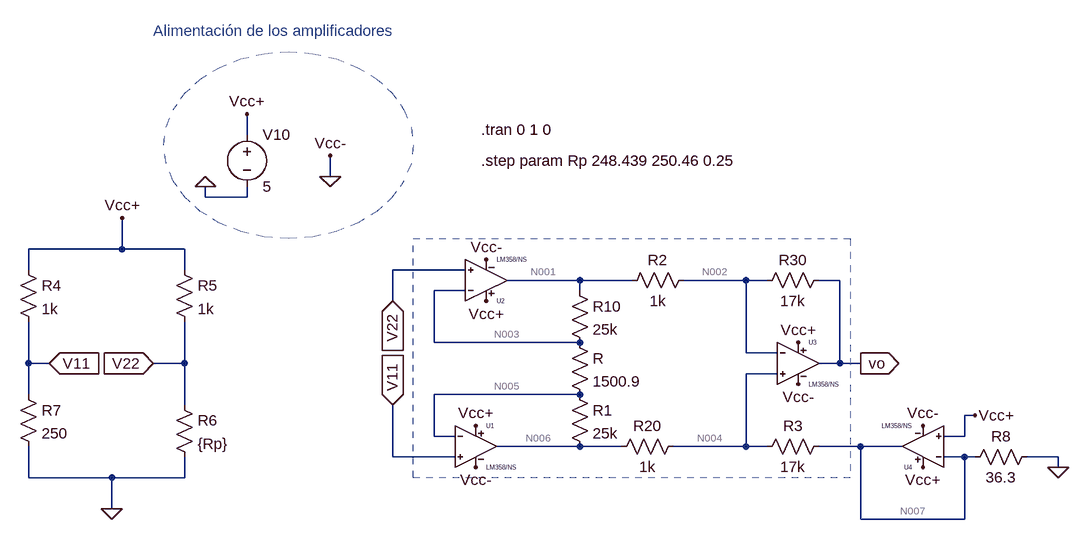
[diagram p0: schematic Ampli+puente.asc]
Ampli+puente.asc, the LTspice schematic file:
Version 4
SHEET 1 1256 680
WIRE -240 -256 -240 -288
WIRE -112 -192 -112 -224
WIRE -304 -160 -304 -176
WIRE -240 -160 -240 -176
WIRE -240 -160 -304 -160
WIRE -432 -80 -432 -128
WIRE -432 -80 -576 -80
WIRE -336 -80 -432 -80
WIRE -576 -48 -576 -80
WIRE -336 -48 -336 -80
WIRE 96 -48 -16 -48
WIRE 272 -32 160 -32
WIRE 352 -32 272 -32
WIRE 528 -32 432 -32
WIRE 560 -32 528 -32
WIRE 672 -32 640 -32
WIRE 96 -16 48 -16
WIRE 272 -16 272 -32
WIRE -16 0 -16 -48
WIRE 48 64 48 -16
WIRE 272 64 48 64
WIRE 528 80 528 -32
WIRE 576 80 528 80
WIRE -576 96 -576 32
WIRE -544 96 -576 96
WIRE -336 96 -336 32
WIRE -336 96 -384 96
WIRE 672 96 672 -32
WIRE 672 96 640 96
WIRE 704 96 672 96
WIRE 576 112 528 112
WIRE -576 144 -576 96
WIRE 272 144 48 144
WIRE -336 160 -336 96
WIRE 880 176 864 176
WIRE 48 208 48 144
WIRE 80 208 48 208
WIRE 864 208 864 176
WIRE 864 208 832 208
WIRE 272 224 144 224
WIRE 336 224 272 224
WIRE 528 224 528 112
WIRE 528 224 416 224
WIRE 560 224 528 224
WIRE 704 224 640 224
WIRE 768 224 704 224
WIRE -16 240 -16 160
WIRE 80 240 -16 240
WIRE 864 240 832 240
WIRE 880 240 864 240
WIRE 1008 240 960 240
WIRE 1008 256 1008 240
WIRE -576 272 -576 224
WIRE -448 272 -576 272
WIRE -336 272 -336 240
WIRE -336 272 -448 272
WIRE -448 320 -448 272
WIRE 704 336 704 224
WIRE 864 336 864 240
WIRE 864 336 704 336
FLAG 704 96 vo
IOPIN 704 96 Out
FLAG -240 -288 Vcc+
FLAG 112 256 Vcc-
FLAG 128 0 Vcc+
FLAG 128 -64 Vcc-
FLAG 112 192 Vcc+
FLAG 608 64 Vcc+
FLAG 608 128 Vcc-
FLAG -112 -224 Vcc-
FLAG -304 -176 0
FLAG -112 -192 0
FLAG -16 0 V22
IOPIN -16 0 In
FLAG -384 96 V22
IOPIN -384 96 In
FLAG -544 96 V11
IOPIN -544 96 In
FLAG -16 160 V11
IOPIN -16 160 In
FLAG 800 256 Vcc+
FLAG 800 192 Vcc-
FLAG 880 176 Vcc+
FLAG 1008 256 0
FLAG -448 320 0
FLAG -432 -128 Vcc+
SYMBOL LM358 112 160 R0
SYMATTR InstName U1
SYMBOL LM358 128 32 M180
SYMATTR InstName U2
SYMBOL LM358 608 32 R0
SYMATTR InstName U3
SYMBOL res 256 -32 R0
SYMATTR InstName R10
SYMATTR Value 25k
SYMBOL res 256 48 R0
SYMATTR InstName R
SYMATTR Value 1500.9
SYMBOL res 256 128 R0
SYMATTR InstName R1
SYMATTR Value 25k
SYMBOL res 448 -48 R90
WINDOW 0 0 56 VBottom 2
WINDOW 3 32 56 VTop 2
SYMATTR InstName R2
SYMATTR Value 1k
SYMBOL res 432 208 R90
WINDOW 0 0 56 VBottom 2
WINDOW 3 32 56 VTop 2
SYMATTR InstName R20
SYMATTR Value 1k
SYMBOL res 656 -48 R90
WINDOW 0 0 56 VBottom 2
WINDOW 3 32 56 VTop 2
SYMATTR InstName R30
SYMATTR Value 17k
SYMBOL voltage -240 -272 R0
WINDOW 123 0 0 Left 0
WINDOW 39 0 0 Left 0
SYMATTR InstName V10
SYMATTR Value 5
SYMBOL res 656 208 R90
WINDOW 0 0 56 VBottom 2
WINDOW 3 32 56 VTop 2
SYMATTR InstName R3
SYMATTR Value 17k
SYMBOL res -592 -64 R0
SYMATTR InstName R4
SYMATTR Value 1k
SYMBOL res -352 -64 R0
SYMATTR InstName R5
SYMATTR Value 1k
SYMBOL res -352 144 R0
SYMATTR InstName R6
SYMATTR Value {Rp}
SYMBOL res -592 128 R0
SYMATTR InstName R7
SYMATTR Value 250
SYMBOL LM358 800 288 R180
SYMATTR InstName U4
SYMBOL res 976 224 R90
WINDOW 0 0 56 VBottom 2
WINDOW 3 32 56 VTop 2
SYMATTR InstName R8
SYMATTR Value 36.3
TEXT 120 -264 Left 2 !.tran 0 1 0
TEXT -384 -416 Left 2 ;Alimentación de los amplificadores
TEXT 120 -216 Left 2 !.step param Rp 248.439 250.46 0.25
RECTANGLE Normal 688 272 16 -96 2
CIRCLE Normal 16 -96 -368 -384 2

The netlist it stands for:
* Ampli+puente.asc
XU1 V11 N005 Vcc+ 0 N006 LM358/NS LM358/NS LM358/NS  ; pins In+ In- V+ V- OUT
XU2 V22 N003 Vcc+ 0 N001 LM358/NS LM358/NS LM358/NS  ; pins In+ In- V+ V- OUT
XU3 N004 N002 Vcc+ 0 vo LM358/NS LM358/NS LM358/NS  ; pins In+ In- V+ V- OUT
R10 N001 N003 25k
R N003 N005 1500.9
R1 N005 N006 25k
R2 N002 N001 1k
R20 N004 N006 1k
R30 vo N002 17k
V10 Vcc+ 0 5
R3 N007 N004 17k
R4 Vcc+ V11 1k
R5 Vcc+ V22 1k
R6 V22 0 {Rp}
R7 V11 0 250
XU4 Vcc+ N007 Vcc+ 0 N007 LM358/NS LM358/NS LM358/NS  ; pins In+ In- V+ V- OUT
R8 0 N007 36.3
.tran 0 1 0
* Alimentación de los amplificadores
.step param Rp 248.439 250.46 0.25
.lib lm358.mod
.backanno
.end

* Results of the author's LTspice run, read from the files saved beside the schematic
* Operating Point (first step), zero values left out:
*   rp = 248.4 
*   V(n005) = 1.002 V
*   V(v11) = 1 V
*   V(vcc+) = 5 V
*   V(n006) = 1.084 V
*   V(n003) = 996.9 mV
*   V(v22) = 995 mV
*   V(n001) = 912.7 mV
*   V(n002) = 1.081 V
*   V(n004) = 1.098 V
*   V(vo) = 3.941 V
*   V(n007) = 1.336 V
*   I(R8) = -36.8 mA
*   I(R7) = 4 mA
*   I(R6) = 4.005 mA
*   I(R5) = 4.005 mA
*   I(R4) = 4 mA
*   I(R3) = 13.98 µA
*   I(R30) = 168.2 µA
*   I(R20) = 14 µA
*   I(R2) = 168.3 µA
*   I(R1) = -3.293 µA
*   I(R) = -3.331 µA
*   I(R10) = -3.369 µA
*   I(V10) = -44.7 mA
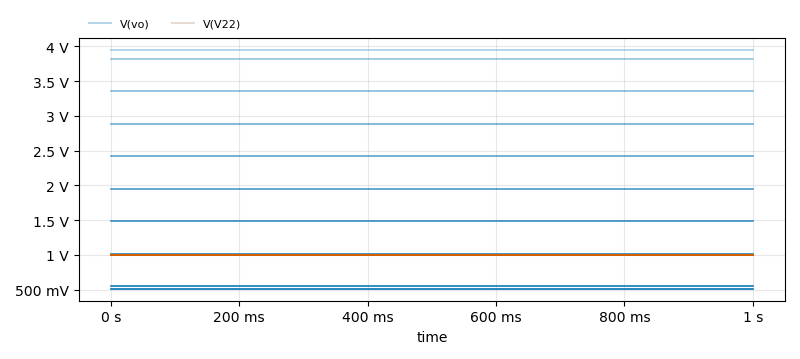
[diagram p1: Transient Analysis of Ampli+puente.asc, plotted from the saved traces]
* Transient Analysis, 10 runs:
*   V(vo) [rp=248.439]: min 3.941 V, max 3.941 V, average 3.941 V, rms 3.941 V, last 3.941 V
*   V(vo) [rp=248.689]: min 3.816 V, max 3.816 V, average 3.816 V, rms 3.816 V, last 3.816 V
*   V(vo) [rp=248.939]: min 3.352 V, max 3.352 V, average 3.352 V, rms 3.352 V, last 3.352 V
*   V(vo) [rp=249.189]: min 2.885 V, max 2.885 V, average 2.885 V, rms 2.885 V, last 2.885 V
*   V(vo) [rp=249.439]: min 2.418 V, max 2.418 V, average 2.418 V, rms 2.418 V, last 2.418 V
*   V(vo) [rp=249.689]: min 1.951 V, max 1.951 V, average 1.951 V, rms 1.951 V, last 1.951 V
*   V(vo) [rp=249.939]: min 1.485 V, max 1.485 V, average 1.485 V, rms 1.485 V, last 1.485 V
*   V(vo) [rp=250.189]: min 1.018 V, max 1.018 V, average 1.018 V, rms 1.018 V, last 1.018 V
*   V(V22) [rp=248.439]: min 995 mV, max 995 mV, average 995 mV, rms 995 mV, last 995 mV
*   V(V22) [rp=248.689]: min 995.8 mV, max 995.8 mV, average 995.8 mV, rms 995.8 mV, last 995.8 mV
*   V(V22) [rp=248.939]: min 996.6 mV, max 996.6 mV, average 996.6 mV, rms 996.6 mV, last 996.6 mV
*   V(V22) [rp=249.189]: min 997.4 mV, max 997.4 mV, average 997.4 mV, rms 997.4 mV, last 997.4 mV
*   V(V22) [rp=249.439]: min 998.2 mV, max 998.2 mV, average 998.2 mV, rms 998.2 mV, last 998.2 mV
*   V(V22) [rp=249.689]: min 999 mV, max 999 mV, average 999 mV, rms 999 mV, last 999 mV
*   V(V22) [rp=249.939]: min 999.8 mV, max 999.8 mV, average 999.8 mV, rms 999.8 mV, last 999.8 mV
*   V(V22) [rp=250.189]: min 1.001 V, max 1.001 V, average 1.001 V, rms 1.001 V, last 1.001 V